# EasyEDA schematic SCH_2023 - Masters Project_2023-11-29.json
TITLE: Node-Arduino-MQTT; REV: 1.0; Date: 2023-10-26; Sheet: 1/1; Drawn By: Jon Marco Reyes; Company: T.I.P Manila
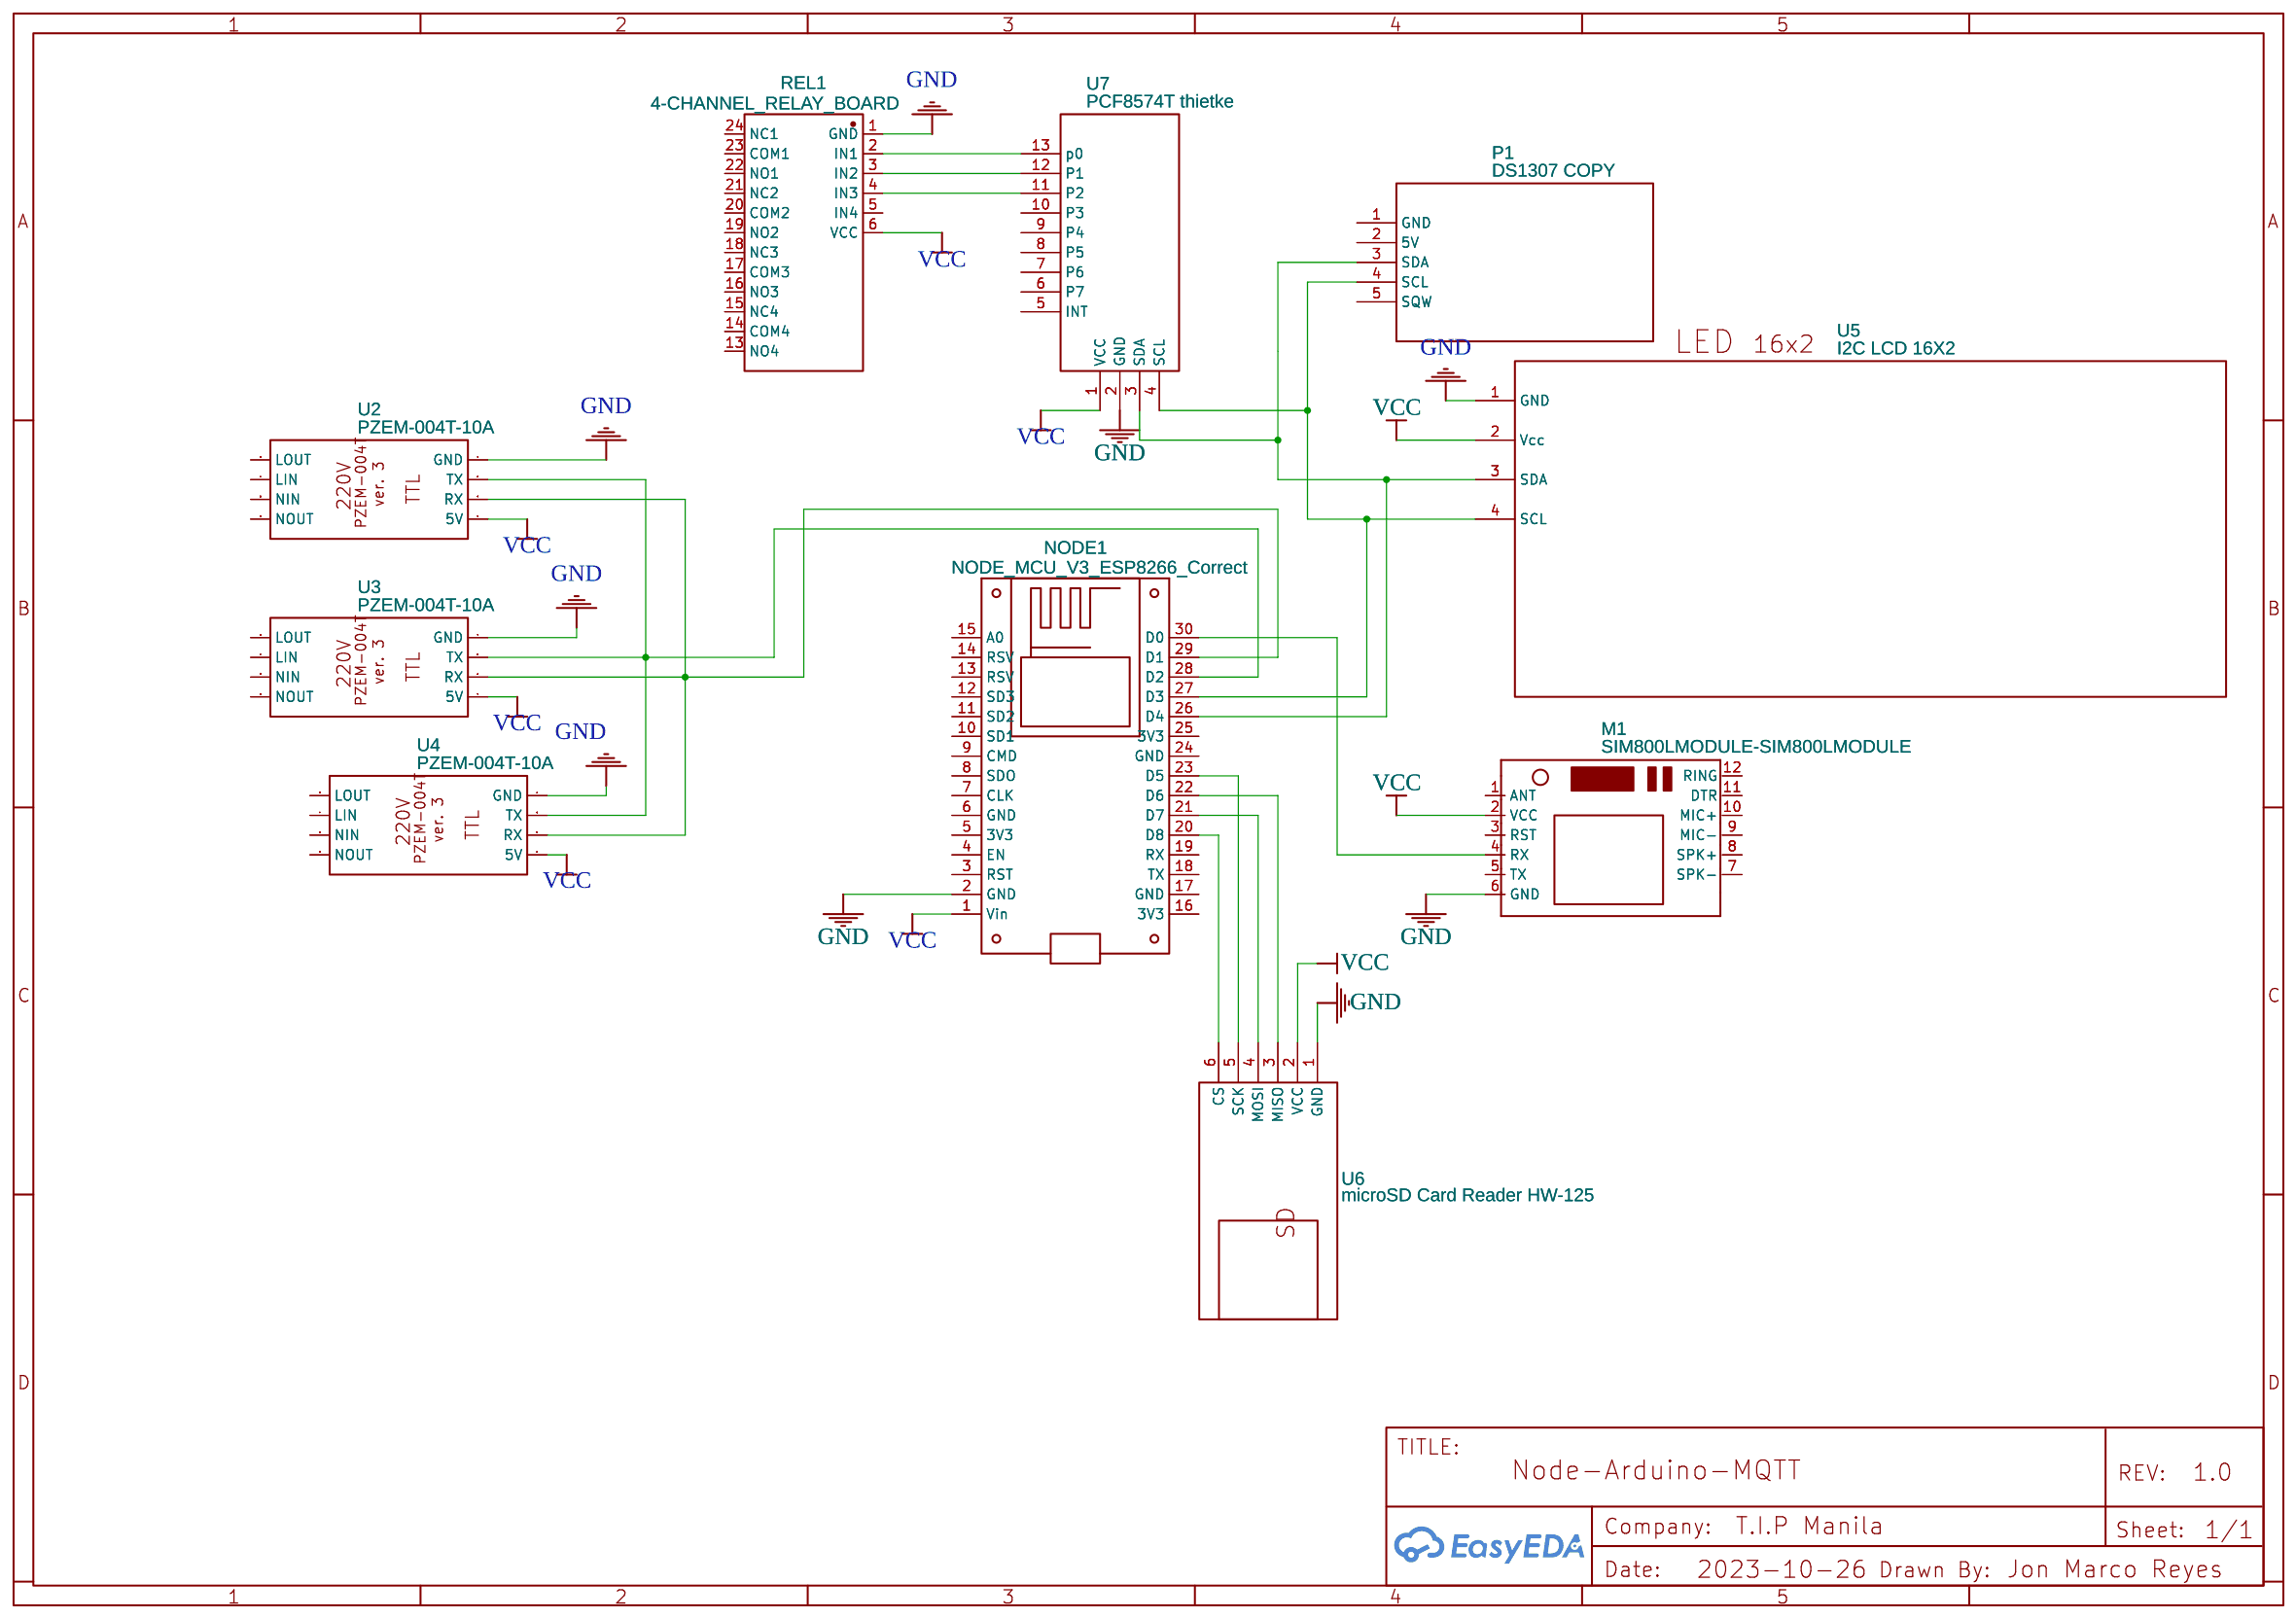
[diagram p0: schematic sheet]

## Parts
M1  SIM800LMODULE-SIM800LMODULE  [SIM800LMODULE_SIM800LMODULE]
NODE1  NODE_MCU_V3_ESP8266_Correct  [NODEMCU-12E;NODEMCU-ESP8266]
P1  DS1307 COPY  [DS1307]
REL1  4-CHANNEL_RELAY_BOARD  [4-CHANNEL_RELAY_BOARD]
U2  PZEM-004T-10A  [PZEM-004T VER. 3]
U3  PZEM-004T-10A  [PZEM-004T VER. 3]
U4  PZEM-004T-10A  [PZEM-004T VER. 3]
U5  I2C LCD 16X2  [I2C LCD-16X2]
U6  microSD Card Reader HW-125  [MICROSD CARD READER HW-125]
U7  PCF8574T thietke  [PCF8574T_M]

## Library data of the parts
M1 = SIM800LMODULE-SIM800LMODULE: Contributor: officine
NODE1 = NODE_MCU_V3_ESP8266_Correct: Contributor: geogeporcel; Supplier: TME
P1 = DS1307 COPY: sourceId: 1T5FDZYC8
REL1 = 4-CHANNEL_RELAY_BOARD: Contributor: marcuson
U2-U4 = PZEM-004T-10A: Contributor: Dewa_Pramudya
U5 = I2C LCD 16X2: Contributor: prashu.ece; sourceId: VlDxP71jB
U6 = microSD Card Reader HW-125: Contributor: allvex
U7 = PCF8574T thietke: Contributor: nguyenducphong

## Nets
GND: M1.6(GND) NODE1.2(GND) REL1.1(GND) U2.4(GND) U3.4(GND) U4.4(GND) U5.1(GND) U6.1(GND) U7.2(GND)
VCC: M1.2(VCC) NODE1.1(Vin) REL1.6(VCC) U2.1(5V) U3.1(5V) U4.1(5V) U5.2(Vcc) U6.2(VCC) U7.1(VCC)
Net-(M1-4): M1.4(RX) NODE1.30(D0)
Net-(NODE1-20): NODE1.20(D8) U6.6(CS)
Net-(NODE1-21): NODE1.21(D7) U6.4(MOSI)
Net-(NODE1-22): NODE1.22(D6) U6.3(MISO)
Net-(NODE1-23): NODE1.23(D5) U6.5(SCK)
Net-(NODE1-26): NODE1.26(D4) P1.3(SDA) U5.3(SDA) U7.3(SDA)
Net-(NODE1-27): NODE1.27(D3) P1.4(SCL) U5.4(SCL) U7.4(SCL)
Net-(NODE1-28): NODE1.28(D2) U2.3(TX) U3.3(TX) U4.3(TX)
Net-(NODE1-29): NODE1.29(D1) U2.2(RX) U3.2(RX) U4.2(RX)
Net-(REL1-2): REL1.2(IN1) U7.13(p0)
Net-(REL1-3): REL1.3(IN2) U7.12(P1)
Net-(REL1-4): REL1.4(IN3) U7.11(P2)

Not connected (* = marked no-connect by the designer): M1 1(ANT) 3(RST) 5(TX) 7(SPK-) 8(SPK+) 9(MIC-) 10(MIC+) 11(DTR) 12(RING); NODE1 3(RST) 4(EN) 5(3V3) 6(GND) 7(CLK) 8(SDO) 9(CMD) 10(SD1) 11(SD2) 12(SD3) 13(RSV) 14(RSV) 15(A0) 16(3V3) 17(GND) 18(TX) 19(RX) 24(GND) 25(3V3); P1 1(GND) 2(5V) 5(SQW); REL1 5(IN4) 13(NO4) 14(COM4) 15(NC4) 16(NO3) 17(COM3) 18(NC3) 19(NO2) 20(COM2) 21(NC2) 22(NO1) 23(COM1) 24(NC1); U2 5(NOUT) 6(NIN) 7(LIN) 8(LOUT); U3 5(NOUT) 6(NIN) 7(LIN) 8(LOUT); U4 5(NOUT) 6(NIN) 7(LIN) 8(LOUT); U7 5(INT) 6(P7) 7(P6) 8(P5) 9(P4) 10(P3)
